# Altium schematic sheet MCU - CAN RS485.SchDoc
size A4; SheetNumber: 4; SheetTotal: 8
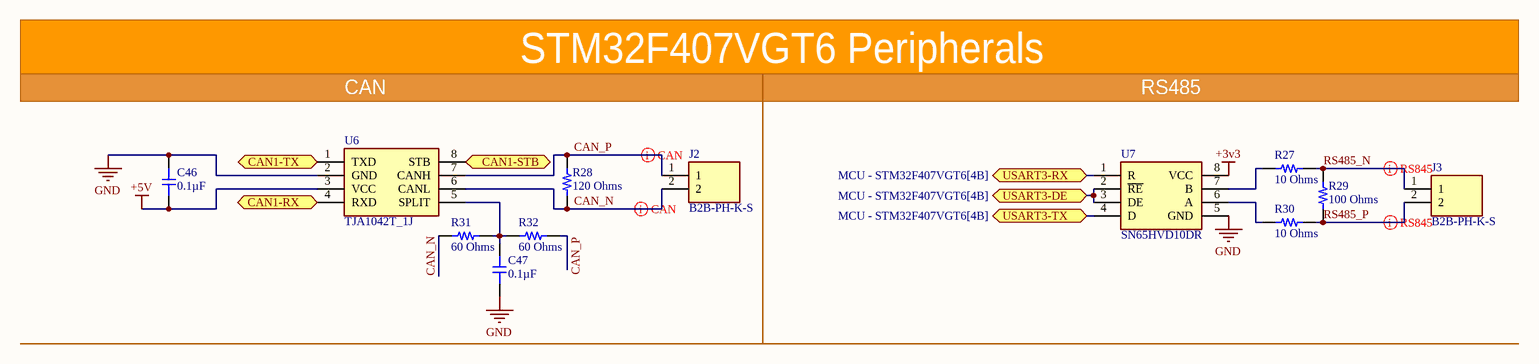
[diagram p0: MCU - CAN RS485.SchDoc]

## Parts
C46  0.1µF  [0603_Footprint]
C47  0.1µF  [0603_Footprint]
J2  B2B-PH-K-S  [JST_B2B-PH-K-S]
J3  B2B-PH-K-S  [JST_B2B-PH-K-S]
R27  10 Ohms  [0603_RES]
R28  120 Ohms  [0603_RES]
R29  100 Ohms  [0603_RES]
R30  10 Ohms  [0603_RES]
R31  60 Ohms  [0603_RES]
R32  60 Ohms  [0603_RES]
U6  TJA1042T_1J  [SOIC127P600X175-8N]
U7  SN65HVD10DR  [SOIC127P600X175-8N]

## Ports
CAN1-RX (bidir, see MCU - STM32F407VGT6[1B]), CAN1-STB (bidir, see MCU - STM32F407VGT6[1B]), CAN1-TX (bidir, see MCU - STM32F407VGT6[1B]), USART3-DE (bidir, see MCU - STM32F407VGT6[4B]), USART3-RX (bidir, see MCU - STM32F407VGT6[4B]), USART3-TX (bidir, see MCU - STM32F407VGT6[4B])

## Nets
+3v3: U7.8(VCC)
+5V: C46.1 U6.3(VCC)
GND: C46.2 C47.2 U6.2(GND) U7.5(GND)
CAN1-RX: U6.4(RXD) ; port CAN1-RX
CAN1-STB: U6.8(STB) ; port CAN1-STB
CAN1-TX: U6.1(TXD) ; port CAN1-TX
CAN_N: J2.2 R28.1 R31.1 U6.6(CANL)
CAN_P: J2.1 R28.2 R32.2 U6.7(CANH)
RS485_N: J3.1 R27.2 R29.2
RS485_P: J3.2 R29.1 R30.2
USART3-DE: U7.2(~{RE}) U7.3(DE) ; port USART3-DE
USART3-RX: U7.1(R) ; port USART3-RX
USART3-TX: U7.4(D) ; port USART3-TX
NetC47_1: C47.1 R31.2 R32.1 U6.5(SPLIT)
NetR27_1: R27.1 U7.7(B)
NetR30_1: R30.1 U7.6(A)

## Layout directives
differential pair; differential pair class RS485: RS485_N, RS485_P
differential pair; differential pair class CAN: CAN_N, CAN_P

## Notes on the sheet
- CAN
- STM32F407VGT6 Peripherals
- RS485

## Library data of the parts
C46 C47 = 0.1uF 0603 Surface Capacitor
J2 J3 = B2B-PH-K-S: Connector Header Through Hole 2 position 0.079 (2.00mm); MF: JST Sales America Inc.; SnapEDA_Link: https://www.snapeda.com/parts/B2B-PH-K-S/JST/view-part/?ref=snap; Package: None; Value: *; MP: B2B-PH-K-S; Check_prices: https://www.snapeda.com/parts/B2B-PH-K-S/JST/view-part/?ref=eda
R27 R30 = 10 Ohm 0603: 10 Ohms 0603
R28 = 120 Ohm 0603
R29 = 100 Ohm 0603
R31 R32 = 60 Ohm 0603
U6 = TJA1042T_1J: Integrated Circuit; Manufacturer_Name: NXP; Manufacturer_Part_Number: TJA1042T/1J; Datasheet Link: http://www.nxp.com/docs/en/data-sheet/TJA1042.pdf; Height: 1.75mm; Mouser Part Number: 771-TJA1042T/1J; Mouser Price/Stock: https://www.mouser.co.uk/ProductDetail/NXP-Semiconductors/TJA1042T-1J?qs=gNSudQoqUYB5nZpx0evBtw%3D%3D; Arrow Part Number: TJA1042T/1J; Arrow Price/Stock: https://www.arrow.com/en/products/tja1042t1j/nxp-semiconductors?region=nac
U7 = SN65HVD10DR: Integrated Circuit; Manufacturer_Name: Texas Instruments; Datasheet Link: http://www.ti.com/lit/gpn/sn65hvd10; Height: 1.75mm; Manufacturer_Part_Number: SN65HVD10DR; Mouser Part Number: 595-SN65HVD10DR; Mouser Price/Stock: https://www.mouser.co.uk/ProductDetail/Texas-Instruments/SN65HVD10DR?qs=QViXGNcIEAviyhAwS0yoXQ%3D%3D; Arrow Part Number: SN65HVD10DR; Arrow Price/Stock: https://www.arrow.com/en/products/sn65hvd10dr/texas-instruments?region=nac